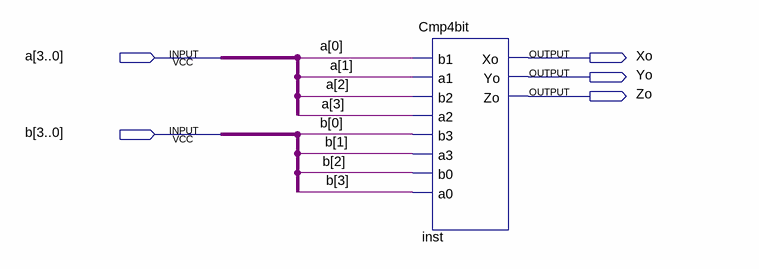
[diagram p0: schematic sheet]
// Quartus schematic CmpDemo.bdf as structural Verilog: 1 symbols, 5 pins
module CmpDemo (
  input  [3:0] a,
  input  [3:0] b,
  output Xo,
  output Yo,
  output Zo
);

  Cmp4bit inst (
    .b1(a[0]), .a1(a[1]), .b2(a[2]), .a2(a[3]), .b3(b[0]), .a3(b[1]), .b0(b[2]), .a0(b[3]), .Xo(Xo), .Yo(Yo),
    .Zo(Zo));
endmodule
